# Altium schematic sheet 725169-03 tik_plc4хх.SchDoc
size 594 x 420 mm; ApprovedBy: Бардин; CheckedBy: Налдаев; Author: Сергеев; CompanyName: ООО НПП ТИК; Address1: Address1; Address2: Address2; Address3: Address3; Address4: Address4; DocumentNumber: ИМБР.467459.070 Э3; Revision: Ревизия; SheetNumber: 1; SheetTotal: Кол страниц; Scale: 1:1; Title2str: Плата ЦПУ; NormInspection: Клочкова; Letter1Column: О1; DocumentType: Схема электрическая принципиальная; FirstReferrence: ИМБР.467459.070; NachOtdela: Клочков; GlavConstructor: Бардин; PageSetup: Record=PageOptions|CenterHorizontal=True|CenterVertical=True|PrintScale=0.67|XCorrection=1.00|YCorrection=1.00|PrintKind=2|BorderSize=5000000|LeftOffset=0|BottomOffset=0|Orientation=2|PaperLength=1000|PaperWidth=1000|Scale=100|PaperSource=7|PrintQuality=-3|MediaType=1|DitherType=10|PrintScaleMode=1|PaperKind=A4|PaperIndex=9; Razrabotal: {Разработал}; Proveril: {Проверил}; Tkontr: {Т.контр}; Nkontr: {Н. контр.}; Utverdil: {Утвердил}; Oboznachenie: {Обозначение}; Naimenovanie: {Наименование}; DecimalNumber: ИМБР.467459.070 Э3; HeadOfSector: Нач. сектора; MainDevice: ИМБР.467459.070; Name: Плата ЦПУ; DocumentName: Название документа
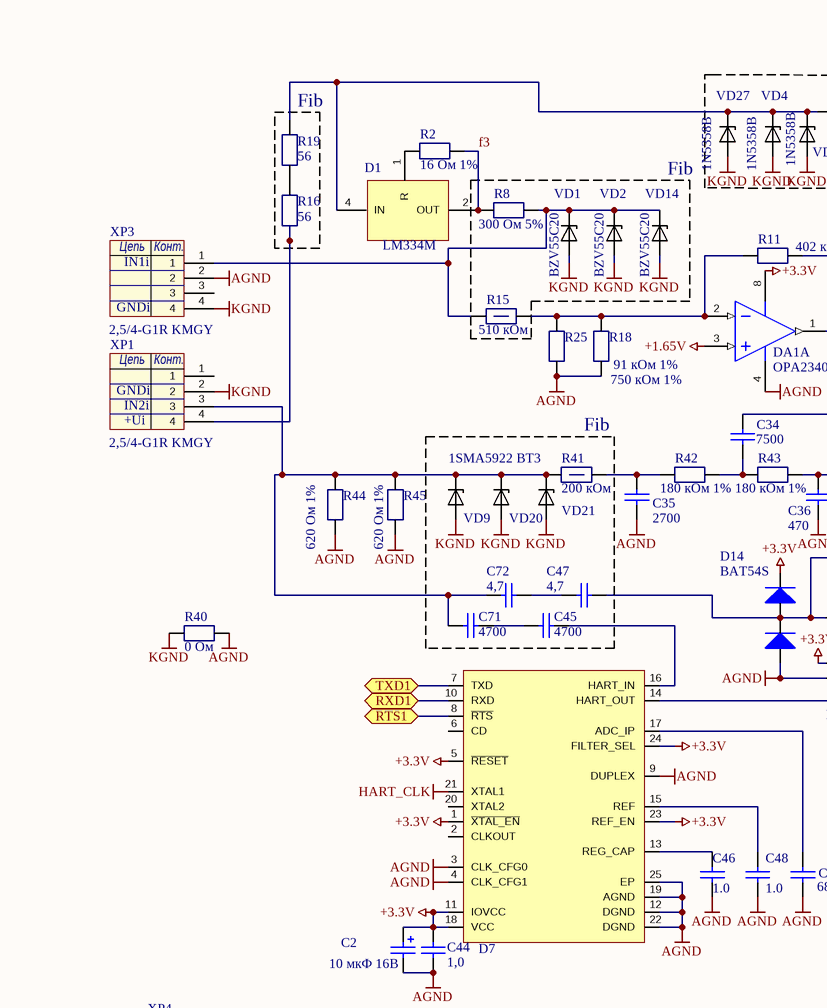
[diagram p0: 725169-03 tik_plc4хх.SchDoc, top left]
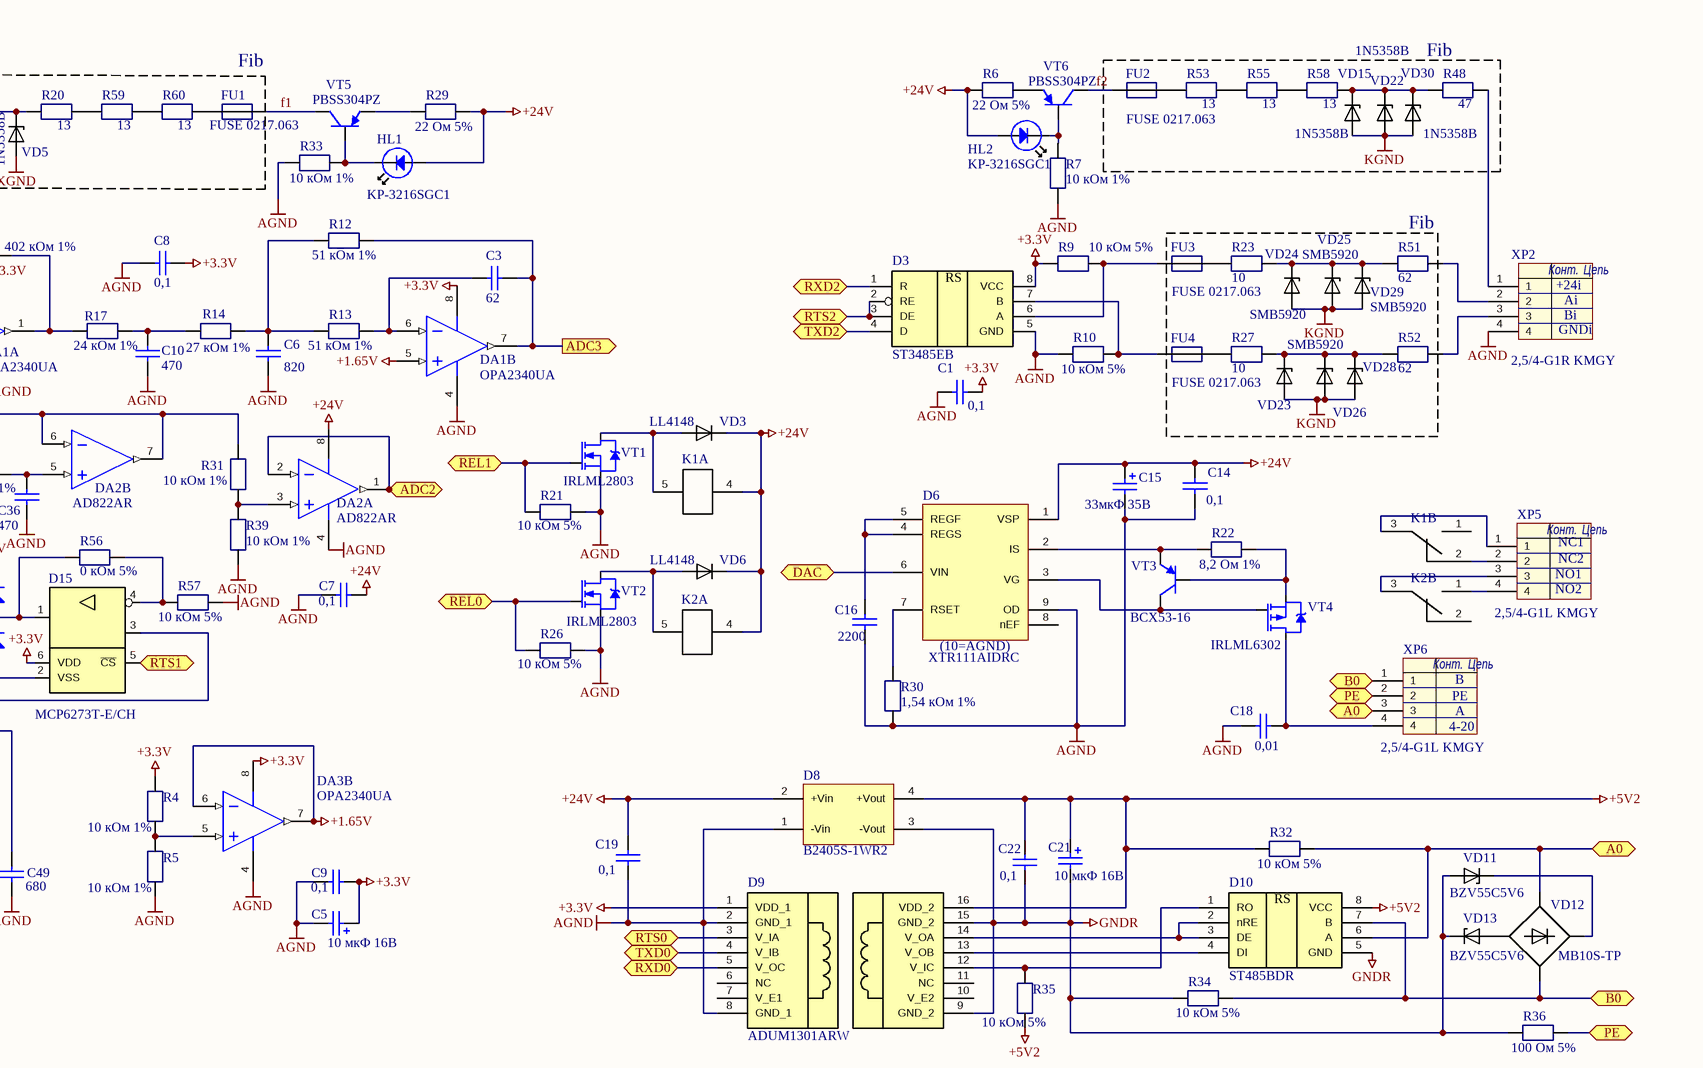
[diagram p1: 725169-03 tik_plc4хх.SchDoc, top right]
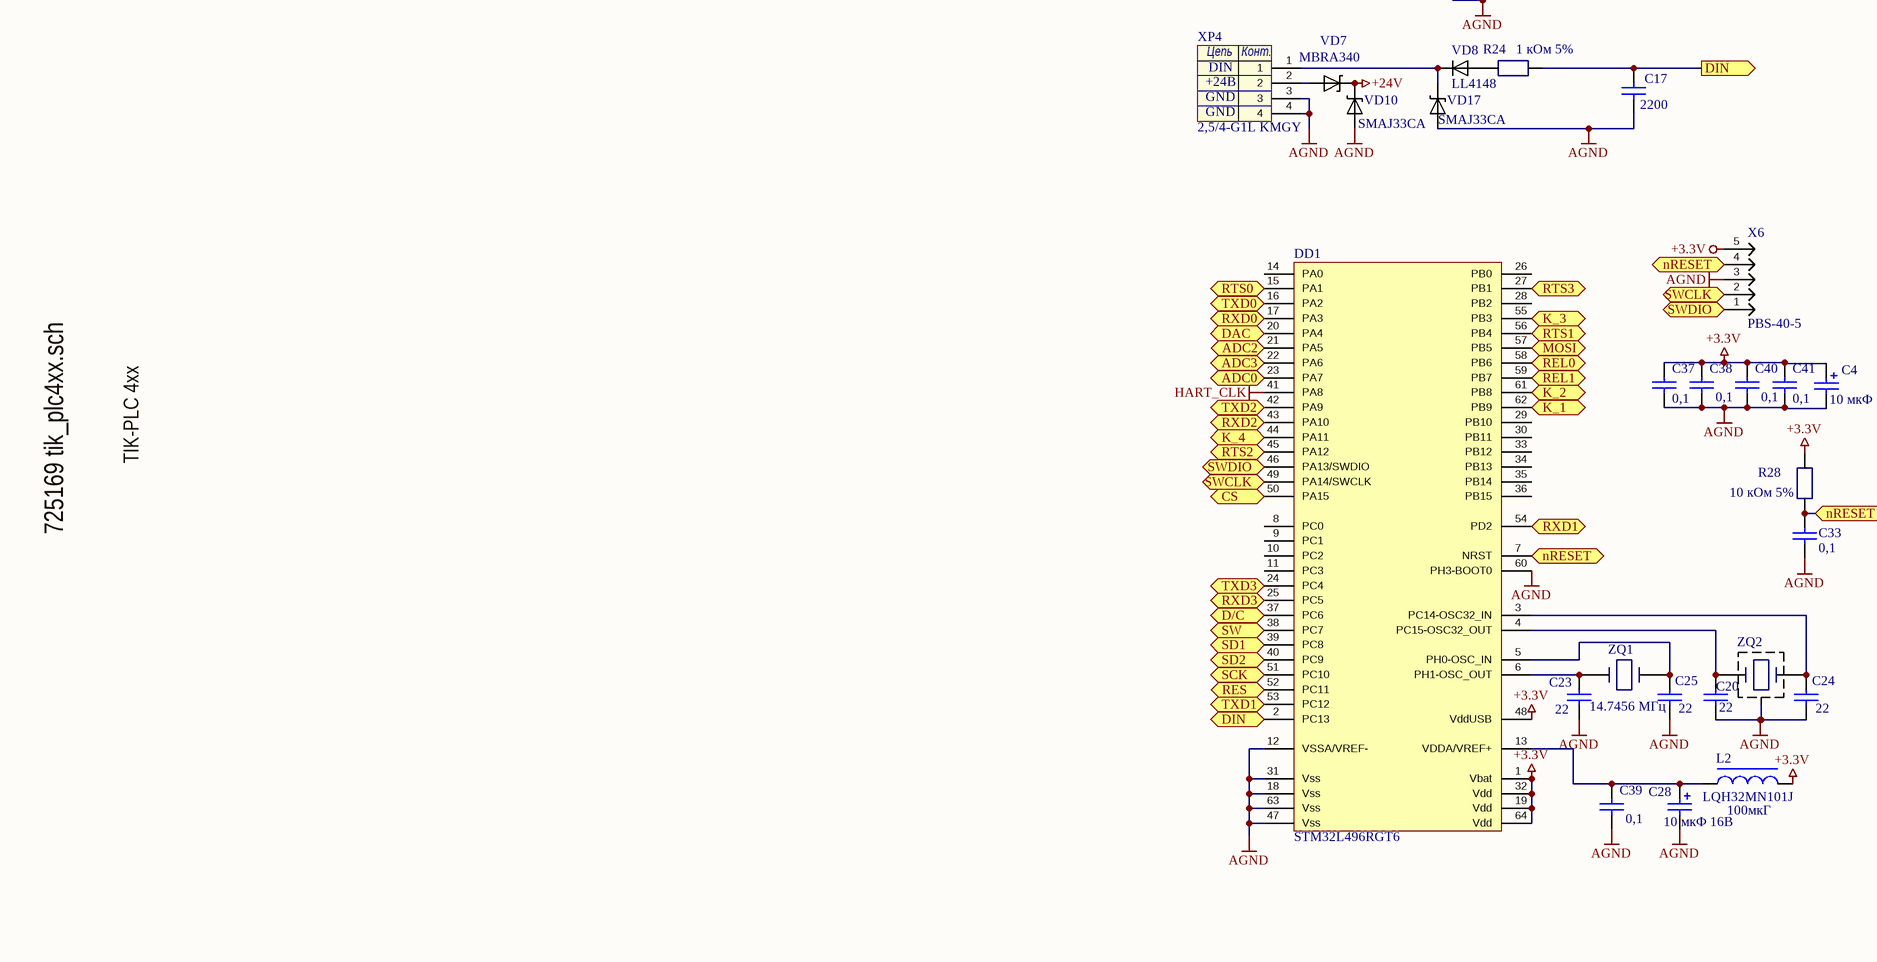
[diagram p2: 725169-03 tik_plc4хх.SchDoc, bottom left]
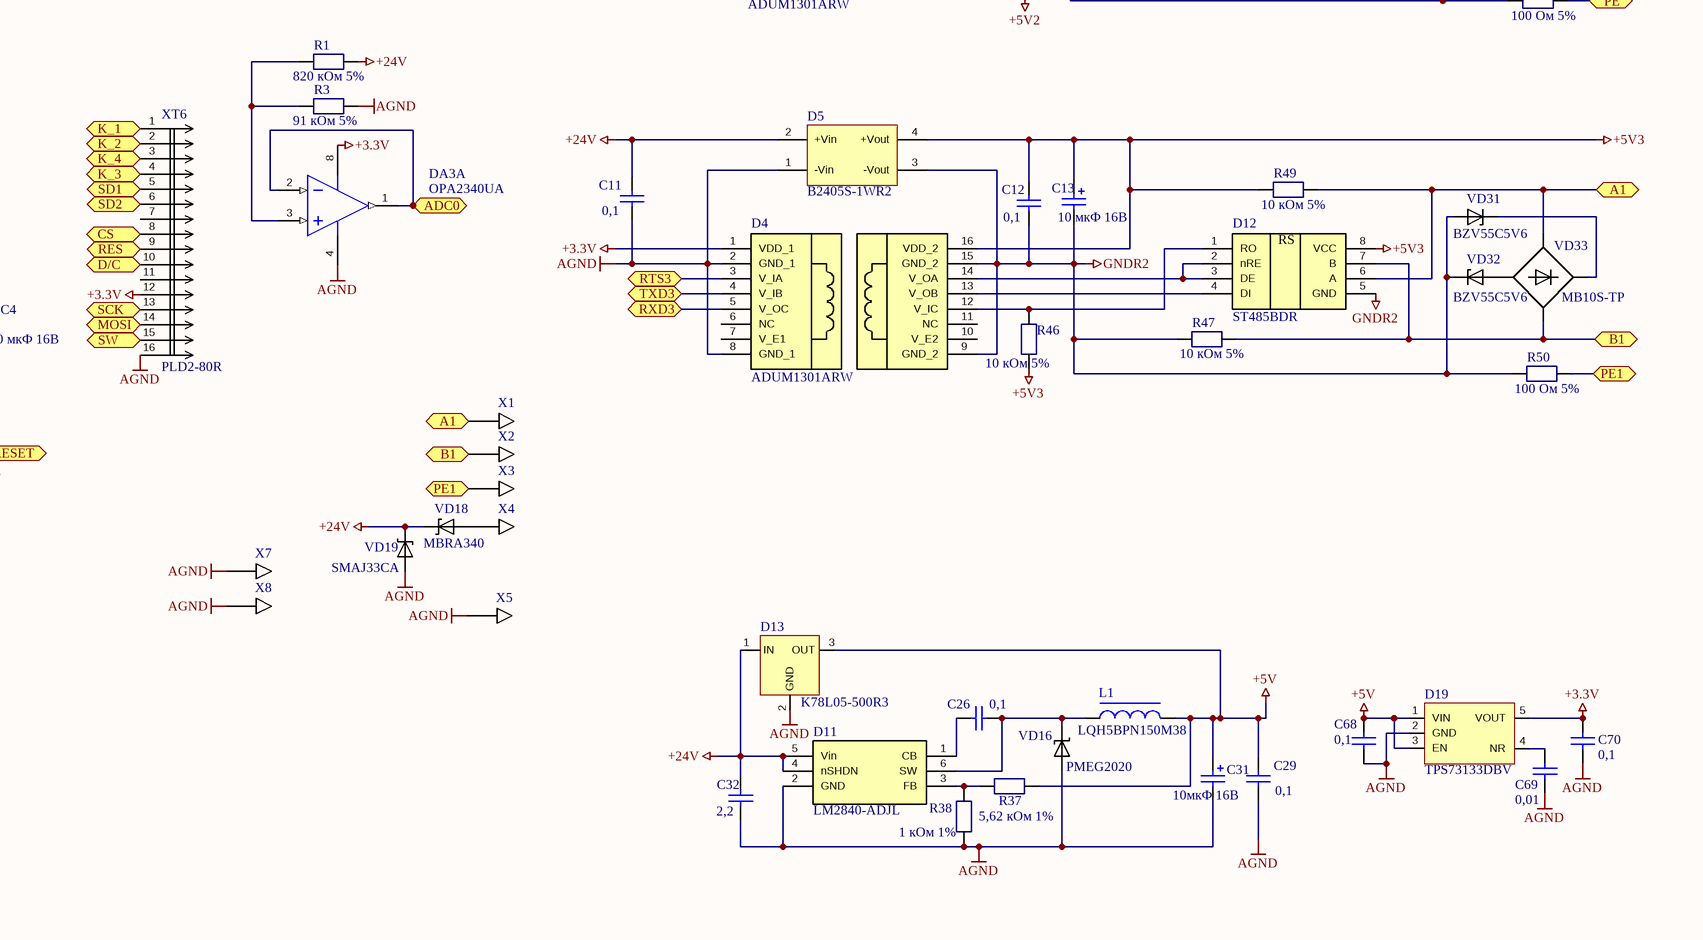
[diagram p3: 725169-03 tik_plc4хх.SchDoc, bottom right]

## Parts
C1  value 0,1  [0805]  (hidden comment: C0805)
C2  10 мкФ 16В  [Case-B]
C3  62  [0805]
C4  10 мкФ 16В  [Case-B]
C5  10 мкФ 16В  [Case-B]
C6  820  [0805]
C7  value 0,1  [0805]  (hidden comment: C0805)
C8  value 0,1  [0805]  (hidden comment: C0805)
C9  value 0,1  [0805]  (hidden comment: C0805)
C10  470  [0805]
C11  value 0,1  [0805]  (hidden comment: C0805)
C12  value 0,1  [0805]  (hidden comment: C0805)
C13  10 мкФ 16В  [Case-B]
C14  value 0,1  [0805]  (hidden comment: C0805)
C15  33мкФ 35В  [Case-D]
C16  2200  [0805]
C17  2200  [0805]
C18  0,01  [0805]
C19  value 0,1  [0805]  (hidden comment: C0805)
C20  value 22  [0805]  (hidden comment: C0805)
C21  10 мкФ 16В  [Case-B]
C22  value 0,1  [0805]  (hidden comment: C0805)
C23  value 22  [0805]  (hidden comment: C0805)
C24  value 22  [0805]  (hidden comment: C0805)
C25  value 22  [0805]  (hidden comment: C0805)
C26  value 0,1  [0805]  (hidden comment: C0805)
C28  10 мкФ 16В  [Case-B]
C29  value 0,1  [0805]  (hidden comment: C0805)
C31  10мкФ 16В  [Case-B]
C32  value 2,2  [0805]  (hidden comment: C0805)
C33  value 0,1  [0805]  (hidden comment: C0805)
C34  7500  [0805]
C35  2700  [0805]
C36  470  [0805]
C37  value 0,1  [0805]  (hidden comment: C0805)
C38  value 0,1  [0805]  (hidden comment: C0805)
C39  value 0,1  [0805]  (hidden comment: C0805)
C40  value 0,1  [0805]  (hidden comment: C0805)
C41  value 0,1  [0805]  (hidden comment: C0805)
C44  value 1,0  [0805]  (hidden comment: C0805)
C45  value 4700  [0805]  (hidden comment: C0805)
C46  value 1.0  [0805]  (hidden comment: C0805)
C47  value 4,7  [0805]  (hidden comment: C0805)
C48  value 1.0  [0805]  (hidden comment: C0805)
C49  value 680  [0805]  (hidden comment: C0805)
C68  value 0,1  [0805]  (hidden comment: C0805)
C69  value 0,01  [0805]  (hidden comment: C0805)
C70  value 0,1  [0805]  (hidden comment: C0805)
C71  value 4700  [0805]  (hidden comment: C0805)
C72  value 4,7  [0805]  (hidden comment: C0805)
D1  LM334М  [SOIC-8]
D3  ST3485EB  [SOIC-8]
D4  ADUM1301ARW  [SOL-16]
D5  B2405S-1WR2  [SIP-4]
D6  XTR111AIDRC  [QFN-10]
D7  AD5700  [QFN24_4x4]  (value not drawn)
D8  B2405S-1WR2  [SIP-4]
D9  ADUM1301ARW  [SOL-16]
D10  ST485BDR  [SOIC-8]
D11  LM2840-ADJL  [G6]
D12  ST485BDR  [SOIC-8]
D13  K78L05-500R3  [K78Lxx-500R3]
D14  BAT54S  [SOT-23]
D15  MCP6273T-E/CH  [SOT23-6]
D19  TPS73133DBV  [SOT23-5]
DA1  OPA2340UA  [SOIC-8]  (parts A,B of 2)
DA2  AD822AR  [SOIC-8]  (parts A,B of 2)
DA3  OPA2340UA  [SOIC-8]  (parts A,B of 2)
DD1  STM32L496RGT6  [LQFP64_L]
FU1  FUSE 0217.063  [FUSE]
FU2  FUSE 0217.063  [FUSE]
FU3  FUSE 0217.063  [FUSE]
FU4  FUSE 0217.063  [FUSE]
HL1  KP-3216SGC1  [KP-3216SGC1]
HL2  KP-3216SGC1  [KP-3216SGC1]
K1  G5Q-14EU-24VDC  [G5Q]  (value not drawn)  (parts A,B of 2)
K2  G5Q-14EU-24VDC  [G5Q]  (value not drawn)  (parts A,B of 2)
L1  LQH5BPN150M38  [LQH5BPN]
L2  LQH32MN101J  value 100мкГ  [1210]
R1  820 кОм 5%  [P1206]
R2  value 16 Ом 1%  [P0805]  (hidden comment: R0805 (1%))
R3  91 кОм 5%  [P1206]
R4  value 10 кОм 1%  [P0805]  (hidden comment: R0805 (1%))
R5  value 10 кОм 1%  [P0805]  (hidden comment: R0805 (1%))
R6  value 22 Ом 5%  [P0805]  (hidden comment: R0805 (1%))
R7  value 10 кОм 1%  [P0805]  (hidden comment: R0805 (1%))
R8  value 300 Ом 5%  [2512]  (hidden comment: R2512 (5%))
R9  value 10 кОм 5%  [P0805]  (hidden comment: R0805 (1%))
R10  value 10 кОм 5%  [P0805]  (hidden comment: R0805 (1%))
R11  402 кОм 1%  [R0805]
R12  51 кОм 1%  [P0805]
R13  51 кОм 1%  [P0805]
R14  27 кОм 1%  [P0805]
R15  value 510 кОм  [C2-33H-0,5]  (hidden comment: C2-33Н-0.5)
R16  value 56  [2512]  (hidden comment: R2512 (5%))
R17  24 кОм 1%  [P0805]
R18  91 кОм 1%  [P0805]
R19  value 56  [2512]  (hidden comment: R2512 (5%))
R20  value 13  [2512]  (hidden comment: R2512 (5%))
R21  value 10 кОм 5%  [P0805]  (hidden comment: R0805 (1%))
R22  value 8,2 Ом 1%  [P0805]  (hidden comment: R0805 (1%))
R23  value 10  [2512]  (hidden comment: R2512 (5%))
R24  1 кОм 5%  [P1206]
R25  750 кОм 1%  [P0805]
R26  value 10 кОм 5%  [P0805]  (hidden comment: R0805 (1%))
R27  value 10  [2512]  (hidden comment: R2512 (5%))
R28  value 10 кОм 5%  [P0805]  (hidden comment: R0805 (1%))
R29  value 22 Ом 5%  [P0805]  (hidden comment: R0805 (1%))
R30  value 1,54 кОм 1%  [P0805]  (hidden comment: R0805 (1%))
R31  value 10 кОм 1%  [P0805]  (hidden comment: R0805 (1%))
R32  value 10 кОм 5%  [P0805]  (hidden comment: R0805 (1%))
R33  value 10 кОм 1%  [P0805]  (hidden comment: R0805 (1%))
R34  value 10 кОм 5%  [P0805]  (hidden comment: R0805 (1%))
R35  value 10 кОм 5%  [P0805]  (hidden comment: R0805 (1%))
R36  value 100 Ом 5%  [P0805]  (hidden comment: R0805 (1%))
R37  value 5,62 кОм 1%  [P0805]  (hidden comment: R0805 (1%))
R38  value 1 кОм 1%  [P0805]  (hidden comment: R0805 (1%))
R39  value 10 кОм 1%  [P0805]  (hidden comment: R0805 (1%))
R40  0 Ом  [P1206]
R41  value 200 кОм  [C2-33H-0,5]  (hidden comment: C2-33Н-0.5)
R42  180 кОм 1%  [P0805]
R43  180 кОм 1%  [P0805]
R44  620 Ом 1%  [P0805]
R45  620 Ом 1%  [P0805]
R46  value 10 кОм 5%  [P0805]  (hidden comment: R0805 (1%))
R47  value 10 кОм 5%  [P0805]  (hidden comment: R0805 (1%))
R48  value 47  [2512]  (hidden comment: R2512 (5%))
R49  value 10 кОм 5%  [P0805]  (hidden comment: R0805 (1%))
R50  value 100 Ом 5%  [P0805]  (hidden comment: R0805 (1%))
R51  value 62  [2512]  (hidden comment: R2512 (5%))
R52  value 62  [2512]  (hidden comment: R2512 (5%))
R53  value 13  [2512]  (hidden comment: R2512 (5%))
R55  value 13  [2512]  (hidden comment: R2512 (5%))
R56  value 0 кОм 5%  [P0805]  (hidden comment: R0805 (1%))
R57  value 10 кОм 5%  [P0805]  (hidden comment: R0805 (1%))
R58  value 13  [2512]  (hidden comment: R2512 (5%))
R59  value 13  [2512]  (hidden comment: R2512 (5%))
R60  value 13  [2512]  (hidden comment: R2512 (5%))
VD1  BZV55C20  [SOD-80 (1)]
VD2  BZV55C20  [SOD-80 (1)]
VD3  LL4148  [SOD-80]
VD4  1N5358B  [DO-201 Vertical]
VD5  1N5358B  [DO-201 Vertical Flip]
VD6  LL4148  [SOD-80]
VD7  MBRA340  [SMA]
VD8  LL4148  [SOD-80 (1)]
VD9  1SMA5922 BT3  [SMA]  (value not drawn)
VD10  SMAJ33СA  [SMA]
VD11  BZV55C5V6  [SOD-80 (1)]
VD12  MB10S-TP  [SOP-4]
VD13  BZV55C5V6  [SOD-80 (1)]
VD14  BZV55C20  [SOD-80 (1)]
VD15  1N5358B  [DO-201 Vertical]
VD16  PMEG2020  [SOD-323]
VD17  SMAJ33СA  [SMA]
VD18  MBRA340  [SMA]
VD19  SMAJ33СA  [SMA]
VD20  1SMA5922 BT3  [SMA]
VD21  1SMA5922 BT3  [SMA]  (value not drawn)
VD22  1N5358B  [DO-201 Vertical Flip]
VD23  SMB5920  [SMB]
VD24  SMB5920  [SMB]
VD25  SMB5920  [SMB]
VD26  SMB5920  [SMB]  (value not drawn)
VD27  1N5358B  [DO-201 Vertical]
VD28  SMB5920  [SMB]  (value not drawn)
VD29  SMB5920  [SMB]
VD30  1N5358B  [DO-201 Vertical Flip]
VD31  BZV55C5V6  [SOD-80 (1)]
VD32  BZV55C5V6  [SOD-80 (1)]
VD33  MB10S-TP  [SOP-4]
VT1  IRLML2803  [SOT-23]
VT2  IRLML2803  [SOT-23]
VT3  BCX53-16  [SOT89]
VT4  IRLML6302  [SOT-23]
VT5  PBSS304PZ  [SOT223]
VT6  PBSS304PZ  [SOT223]
X1  (no value)  [P-polygon]
X2  (no value)  [P-polygon]
X3  (no value)  [P-polygon]
X4  (no value)  [P-polygon]
X5  (no value)  [P-polygon]
X6  PBS-40-5  [PLS-40-5 (1)]
X7  (no value)  [P-circle 2-d1]
X8  (no value)  [P-circle 2-d1]
XP1  XP3  [MSTBO-2.5/4-G1R]  (value not drawn)
XP2  XT?  [MSTBO-2.5/4-G1R]  (value not drawn)
XP3  XP1  [MSTBO-2.5/4-G1R]  (value not drawn)
XP4  XT4  [MSTBO-2.5/4-G1L]  (value not drawn)
XP5  XT4  [MSTBO-2.5/4-G1L]  (value not drawn)
XP6  XT5  [MSTBO-2.5/4-G1L]  (value not drawn)
XT6  PLD2-80R  [PlD2-16R---]
ZQ1  14.7456 МГц  [HC-49/U]
ZQ2  (no value)  [DT-38T]

## Blocks framed on the sheet
Fib: FU2 R48 R53 R55 R58 VD15 VD22 VD30
Fib: R16 R19
Fib: FU1 R20 R59 R60 VD4 VD5 VD27
Fib: R8 R15 VD1 VD2 VD14
Fib: FU3 FU4 R23 R27 R51 R52 VD23-VD26 VD28 VD29
Fib: C45 C47 C71 C72 R41 VD9 VD20 VD21

## Ports
A0, A1, A1 (in), ADC0 (out), ADC2, ADC3 (out), B0, B1, B1 (in), CS, D/C, DAC, DIN (in), DIN (out), K_1, K_2, K_3, K_4, MOSI, nRESET, PE, PE1, PE1 (in), REL0, REL0 (out), REL1, REL1 (out), RES, RTS0, RTS1, RTS2, RTS3, RXD0, RXD1, RXD2, RXD3, SCK, SD1, SD1 (in), SD2, SW (in), SW (out), SWCLK, SWDIO, TXD0, TXD1, TXD2, TXD3

## Nets
+1.65V: DA1.3(IN+) DA1.5(IN+) DA3.6(IN-) DA3.7(OUT)
+3.3V: C1.2 C2.1 C4.1 C5.1 C8.1 C9.1 C37.2 C38.2 C40.2 C41.2 C44.2 C70.2 D3.8(VCC) D4.1(VDD_1) D7.1(~{XTAL_EN}) D7.5(~{RESET}) D7.11(IOVCC) D7.18(VCC) D7.23(REF_EN) D7.24(FILTER_SEL) D9.1(VDD_1) D14.2(A2) D15.6(VDD) D19.5(VOUT) DA1.8(V+) DA3.8(V+) DD1.1(Vbat) DD1.19(Vdd) DD1.32(Vdd) DD1.48(VddUSB) DD1.64(Vdd) L2.2 R4.2 R9.1 R28.1 X6.5 XT6.12
+5V: C29.2 C31.1 C68.2 D13.3(OUT) D19.1(VIN) D19.3(EN) L1.2 R37.2
+5V2: C21.1 C22.2 D8.4(+Vout) D9.16(VDD_2) D10.8(VCC) R32.2 R35.2
+5V3: C12.2 C13.1 D4.16(VDD_2) D5.4(+Vout) D12.8(VCC) R46.2 R49.2
+24V: C7.1 C11.2 C14.1 C15.1 C19.2 C32.2 D5.2(+Vin) D6.1(VSP) D8.2(+Vin) D11.4(nSHDN) D11.5(Vin) D13.1(IN) DA2.8(V+) HL1.1(A) HL2.1(A) K1.4(A) K2.4(A) R1.1 R6.1 R29.2 VD3.1(K) VD6.1(K) VD7.1(K) VD10.1(K) VD18.1(K) VD19.1(K)
AGND: C1.1 C2.2 C4.2 C5.2 C6.2 C7.2 C8.2 C9.2 C10.2 C11.1 C14.2 C15.2 C16.2 C17.2 C18.1 C19.1 C20.1 C23.1 C24.1 C25.1 C28.2 C29.1 C31.2 C32.1 C33.1 C35.2 C36.2 C37.1 C38.1 C39.1 C40.1 C41.1 C44.1 C46.1 C48.1 C49.1 C68.1 C69.1 C70.1 D3.5(GND) D4.2(GND_1) D4.8(GND_1) D5.1(-Vin) D6.9(OD) D6.10 D6.11 D7.3(CLK_CFG0) D7.4(CLK_CFG1) D7.9(DUPLEX) D7.12(DGND) D7.19(AGND) D7.22(DGND) D7.25(EP) D8.1(-Vin) D9.2(GND_1) D9.8(GND_1) D11.2(GND) D13.2(GND) D14.1(A1) D15.2(VSS) D19.2(GND) DA1.4(V-) DA2.4(V-) DA3.4(V-) DD1.12(VSSA/VREF-) DD1.18(Vss) DD1.31(Vss) DD1.47(Vss) DD1.60(PH3-BOOT0) DD1.63(Vss) R3.1 R5.1 R7.2 R10.2 R18.2 R21.1 R25.2 R26.1 R30.2 R33.1 R38.2 R39.1 R40.2 R44.2 R45.2 R57.2 VD10.2(A) VD16.1(A) VD17.2(A) VD19.2(A) VT1.2(S) VT2.2(S) X5.1(X) X6.3 X7.1(X) X8.1(X) XP2.4 XP3.2 XP4.3 XP4.4 XT6.16 ZQ2.3
f1: FU1.1 VT5.2(C) VT5.4
f2: FU2.2 VT6.2(C) VT6.4
f3: D1.2(OUT) D1.3 D1.6 D1.7 R2.1 R8.2
GNDR: C21.2 C22.1 D8.3(-Vout) D9.9(GND_2) D9.15(GND_2) D10.5(GND) R34.2 R36.2 VD11.2(A) VD13.1(K)
GNDR2: C12.1 C13.2 D4.9(GND_2) D4.15(GND_2) D5.3(-Vout) D12.5(GND) R47.2 R50.2 VD31.2(A) VD32.1(K)
HART_CLK: D7.21(XTAL1) DD1.41(PA8)
KGND: R40.1 VD1.2(A) VD2.2(A) VD4.2(A) VD5.2(A) VD9.2(A) VD14.2(A) VD15.2(A) VD20.2(A) VD21.2(A) VD22.2(A) VD23.2(A) VD24.2(A) VD25.2(A) VD26.2(A) VD27.2(A) VD28.2(A) VD29.2(A) VD30.2(A) XP1.2 XP3.4
A0: D10.6(A) R32.1 VD12.1 XP6.3 ; port A0
A1: D12.6(A) R49.1 VD33.1 X1.1(X) ; port A1
ADC0: DA3.1(OUT) DA3.2(IN-) DD1.23(PA7) ; port ADC0
ADC2: DA2.1(OUT1) DA2.2(IN1-) DD1.21(PA5) ; port ADC2
ADC3: C3.2 DA1.7(OUT) DD1.22(PA6) R12.1 ; port ADC3
B0: D10.7(B) R34.1 VD12.2 XP6.1 ; port B0
B1: D12.7(B) R47.1 VD33.2 X2.1(X) ; port B1
CS: DD1.50(PA15) XT6.8 ; port CS
D/C: DD1.37(PC6) XT6.10 ; port D/C
DAC: D6.6(VIN) DD1.20(PA4) ; port DAC
DIN: C17.1 DD1.2(PC13) R24.2 ; port DIN
K_1: DD1.62(PB9) XT6.1 ; port K_1
K_2: DD1.61(PB8) XT6.2 ; port K_2
K_3: DD1.55(PB3) XT6.4 ; port K_3
K_4: DD1.44(PA11) XT6.3 ; port K_4
MOSI: DD1.57(PB5) XT6.14 ; port MOSI
nRESET: C33.2 DD1.7(NRST) R28.2 X6.4 ; port nRESET
PE: R36.1 XP6.2 ; port PE
PE1: R50.1 X3.1(X) ; port PE1
REL0: DD1.58(PB6) R26.2 VT2.1(G) ; port REL0
REL1: DD1.59(PB7) R21.2 VT1.1(G) ; port REL1
RES: DD1.52(PC11) XT6.9 ; port RES
RTS0: D9.3(V_IA) DD1.15(PA1) ; port RTS0
RTS1: D7.8(~{RTS}) D15.5(~{CS}) DD1.56(PB4) ; port RTS1
RTS2: D3.2(RE) D3.3(DE) DD1.45(PA12) ; port RTS2
RTS3: D4.3(V_IA) DD1.27(PB1) ; port RTS3
RXD0: D9.5(V_OC) DD1.17(PA3) ; port RXD0
RXD1: D7.10(RXD) DD1.54(PD2) ; port RXD1
RXD2: D3.1(R) DD1.43(PA10) ; port RXD2
RXD3: D4.5(V_OC) DD1.25(PC5) ; port RXD3
SCK: DD1.51(PC10) XT6.13 ; port SCK
SD1: DD1.39(PC8) XT6.5 ; port SD1
SD2: DD1.40(PC9) XT6.6 ; port SD2
SW: DD1.38(PC7) XT6.15 ; port SW
SWCLK: DD1.49(PA14/SWCLK) X6.2 ; port SWCLK
SWDIO: DD1.46(PA13/SWDIO) X6.1 ; port SWDIO
TXD0: D9.4(V_IB) DD1.16(PA2) ; port TXD0
TXD1: D7.7(TXD) DD1.53(PC12) ; port TXD1
TXD2: D3.4(D) DD1.42(PA9) ; port TXD2
TXD3: D4.4(V_IB) DD1.24(PC4) ; port TXD3
NetC3_1: C3.1 DA1.6(IN-) R13.1
NetC6_1: C6.1 R12.2 R13.2 R14.1
NetC10_1: C10.1 R14.2 R17.2
NetC16_1: C16.1 D6.4(REGS) D6.5(REGF)
NetC18_2: C18.2 VT4.3(D) XP6.4
NetC20_2: C20.2 DD1.4(PC15-OSC32_OUT) ZQ2.1
NetC23_2: C23.2 DD1.6(PH1-OSC_OUT) ZQ1.2
NetC24_2: C24.2 DD1.3(PC14-OSC32_IN) ZQ2.2
NetC25_2: C25.2 DD1.5(PH0-OSC_IN) ZQ1.1
NetC26_1: C26.1 D11.6(SW) L1.1 VD16.2(K)
NetC26_2: C26.2 D11.1(CB)
NetC28_1: C28.1 C39.2 DD1.13(VDDA/VREF+) L2.1
NetC34_1: C34.1 R42.2 R43.1
NetC34_2: C34.2 DA2.6(IN2-) DA2.7(OUT2) R31.1
NetC35_1: C35.1 R41.1 R42.1
NetC36_1: C36.1 DA2.5(IN2+) R43.2
NetC45_1: C45.1 D7.16(HART_IN)
NetC45_2: C45.2 C71.2
NetC46_2: C46.2 D7.13(REG_CAP)
NetC47_1: C47.1 D14.3(K) D15.1 R56.1
NetC47_2: C47.2 C72.2
NetC48_2: C48.2 D7.15(REF)
NetC49_2: C49.2 D7.17(ADC_IP)
NetC69_2: C69.2 D19.4(NR)
NetC71_1: C71.1 C72.1 R41.2 R44.1 R45.1 VD9.1(K) VD20.1(K) VD21.1(K) XP1.3
NetD1_1: D1.1(R) R2.2
NetD1_4: D1.4(IN) R19.2 R20.1 VD4.1(K) VD5.1(K) VD27.1(K)
NetD3_6: D3.6(A) FU3.2 R9.2
NetD3_7: D3.7(B) FU4.2 R10.1
NetD4_12: D4.12(V_IC) D12.1(RO) R46.1
NetD4_13: D4.13(V_OB) D12.4(DI)
NetD4_14: D4.14(V_OA) D12.2(nRE) D12.3(DE)
NetD6_2: D6.2(IS) R22.2 VT3.1(E)
NetD6_3: D6.3(VG) VT3.2(C) VT4.1(G)
NetD6_7: D6.7(RSET) R30.1
NetD7_14: D7.14(HART_OUT) D15.3
NetD9_12: D9.12(V_IC) D10.1(RO) R35.1
NetD9_13: D9.13(V_OB) D10.4(DI)
NetD9_14: D9.14(V_OA) D10.2(nRE) D10.3(DE)
NetD11_3: D11.3(FB) R37.1 R38.1
NetD15_4: D15.4 R56.2 R57.1
NetDA1_1: DA1.1(OUT) R11.1 R17.1
NetDA1_2: DA1.2(IN-) R11.2 R15.1 R18.1 R25.1
NetDA2_3: DA2.3(IN1+) R31.2 R39.2
NetDA3_3: DA3.3(IN+) R1.2 R3.2
NetDA3_5: DA3.5(IN+) R4.1 R5.2
NetFU1_2: FU1.2 R60.2
NetFU2_1: FU2.1 R53.1
NetFU3_1: FU3.1 R23.1
NetFU4_1: FU4.1 R27.1
NetHL1_2: HL1.2(K) R33.2 VT5.1(B)
NetHL2_2: HL2.2(K) R7.1 VT6.1(B)
NetK1_2: K1.2(lock) XP5.2
NetK1_3: K1.3(over) XP5.1
NetK1_5: K1.5(B) VD3.2(A) VT1.3(D)
NetK2_1: K2.1(open) XP5.4
NetK2_3: K2.3(over) XP5.3
NetK2_5: K2.5(B) VD6.2(A) VT2.3(D)
NetR6_2: R6.2 VT6.3(E)
NetR8_1: R8.1 R15.2 VD1.1(K) VD2.1(K) VD14.1(K) XP3.1
NetR16_1: R16.1 XP1.4
NetR16_2: R16.2 R19.1
NetR20_2: R20.2 R59.1
NetR22_1: R22.1 VT3.3(B) VT4.2(S)
NetR23_2: R23.2 R51.1 VD24.1(K) VD25.1(K) VD29.1(K)
NetR24_1: R24.1 VD8.2(A)
NetR27_2: R27.2 R52.1 VD23.1(K) VD26.1(K) VD28.1(K)
NetR29_1: R29.1 VT5.3(E)
NetR48_1: R48.1 R58.2 VD15.1(K) VD22.1(K) VD30.1(K)
NetR48_2: R48.2 XP2.1
NetR51_2: R51.2 XP2.2
NetR52_2: R52.2 XP2.3
NetR53_2: R53.2 R55.1
NetR55_2: R55.2 R58.1
NetR59_2: R59.2 R60.1
NetVD7_2: VD7.2(A) XP4.2
NetVD8_1: VD8.1(K) VD17.1(K) XP4.1
NetVD11_1: VD11.1(K) VD12.3(+)
NetVD12_4: VD12.4(-) VD13.2(A)
NetVD18_2: VD18.2(A) X4.1(X)
NetVD31_1: VD31.1(K) VD33.3(+)
NetVD32_2: VD32.2(A) VD33.4(-)

Not connected (* = marked no-connect by the designer): D4 6(NC) 7(V_E1) 10(V_E2) 11(NC); D6 8(nEF); D7 2(CLKOUT) 6(CD) 20(XTAL2); D9 6(NC) 7(V_E1) 10(V_E2) 11(NC); DD1 8(PC0) 9(PC1) 10(PC2) 11(PC3) 14(PA0) 26(PB0) 28(PB2) 29(PB10) 30(PB11) 33(PB12) 34(PB13) 35(PB14) 36(PB15); K1 1(open); K2 2(lock); XP1 1; XP3 3; XT6 7 11

## Notes on the sheet
- (near XP3) GNDi
- (near XP3) IN1i
- (near XP2) +24i
- (near XP2) Ai
- (near XP2) Bi
- (near XP1) GNDi
- (near XP2) GNDi
- (near XP1) IN2i
- (near XP1) +Ui
- (near XP5) NC1
- (near XP5) NO2
- (near XP5) NO1
- (near XP5) NC2
- PE
- B
- (near XP6) 4-20
- (near XP6) A
- (near XP4) +24B
- (near XP4) GND
- (near XP4) DIN
- TIK-PLC 4хх
- 725169 tik_plc4хх.sch
- Перв.примен.
- Справ.№
- Подп. и дата
- Инв.№ дубл.
- Взам.инв.№
- Подп.и дата
- Разраб.
- Изм.
- Лист
- № докум.
- Подп.
- Дата
- Лит.
- Масштаб
- Масса
- Т.контр.
- Пров.
- СХЕМА   ЭЛЕКТРИЧЕСКАЯ
- ПРИНЦИПИАЛЬНАЯ
- Листов
- Инв.№ подл.
- Утв.
- Н.контр.
- Нач.сект.
- Формат  A2
- (in symbol ADM485AR) RS
- (in symbol ST3485EB) RS
- (in symbol TB-) Цепь; Конт.; 2,5/4-G1R KMGY; 2,5/4-G1L KMGY
- (in symbol XTR111) (10=AGND)

## Library data of the parts
C1 C7-C9 C11 C12 C14 C19 C22 C26 C29 C33 C37-C41 C44 C68-C70 = C0805: Чип конденсатор 0805; SP: X7R-0,1 мкФ ±10% -50В
C2 C4 C5 C13 C21 C28 = Tantal "B": Чип конденсатор танталовый "B"; SP: Конденсатор КТ-16В-10 мкФ 10% "B"; Value: 10 мкФ 16В
C3 = C1812: SP: NPO-6800пФ ±5% -50В; Value: 62
C6 = C1812: SP: NPO-2700пФ ±5% -50В; Value: 820
C10 = C1812: SP: X7R-1 мкФ ±10% -50В; Value: 470
C15 = Tantal "C": Чип конденсатор танталовый "C"; SP: Чип конденсатор 47 мкФ 10В 20% "С"; Value: 33мкФ 35В
C16 C17 = C1812: SP: X7R-2200пФ ±10% -50В; Value: 2200
C18 = C1812: SP: X7R-0,01 мкФ ±10% -50В; Value: 0,01
C20 C23-C25 = C0805: Чип конденсатор 0805; SP: NPO-22пФ ±5% -50В
C31 = Tantal "A": Чип конденсатор танталовый "B"; SP: Конденсатор КТ-16В-10 мкФ 10% "B"; Value: 10мкФ 16В
C32 = C0805: Чип конденсатор 0805; SP: X7R-2,2 мкФ ±10% -50В
C34 = C1812: SP: NPO-1500 пФ ±5% -50В; Value: 7500
C35 = C1812: SP: NPO-1000 пФ ±5% -50В; Value: 2700
C36 = C1812: SP: NPO-100 пФ ±5% -50В; Value: 470
C45 = C0805: Чип конденсатор 0805; SP: X7R-2200 пФ ±10% -50В
C46 C48 = C0805: Чип конденсатор 0805; SP: X7R-1 мкФ ±10% -50В
C47 = C0805: Чип конденсатор 0805; SP: X7R-2.2 мкФ ±10% -50В
C49 = C0805: Чип конденсатор 0805; SP: X7R-680 пФ ±10% -50В
C71 C72 = C0805: Чип конденсатор 0805; SP: Чип конденсатор 0805 X7R 0,1 мкФ 10% 50В
D1 = REF30: SP: Микросхема LM334М; Value: LM334М
D3 = ST3485EB: UART to RS485; Value: ST3485EB
D4 D9 = ADUM1301ARW: SP: Микросхема ADUM1301ARW; Value: ADUM1301ARW
D5 D8 = AM1S-0505SZ: DC-DC изолированный преобразователь; SP: Микросхема TME0505S; Value: B2405S-1WR2
D6 = XTR111: АЦП 16-Bit, 100 kSPS PulSAR; SP: Микросхема XTR111AIDRC; Value: XTR111AIDRC
D7 = AD5700: AD5700 Low Power HART Modem; Value: AD5700
D10 D12 = ADM485AR: SP: Микросхема ST485BDR; Value: ST485BDR
D11 = LM2840: SP: Микросхема LM2840-ADJL; Value: LM2840-ADJL
D13 = K78Lxx-500R3: Step Down DC-DC; SP: K78Lxx-500R3; Value: K78L05-500R3
D15 = MCP6273T-E/CH: 170 µA, 2 MHz Rail-to-Rail Op Amp; Value: MCP6273T-E/CH
D19 = TPS73133DBV: Источник опорного напряжения 2.5В, SOT23; SP: TPS73133DBV
DA1 DA3 = OPA2340: 2.7V, 5.5MHz Rail-to-Rail I/O Amplifier; SP: OPA2340UA
DD1 = STM32L4A6RG: Ultra-low-power with FPU Arm Cortex-M4 MCU 80 MHz with 1 Mbyte Flash memory, 320 Kbyte of SRAM; Value: STM32L496RGT6
FU1-FU4 = FUSE 216: SP: Предохранитель FUSE 0217.063; Value: FUSE 0217.063
HL1 = KP-3216SGC1: SP: Светодиод KP-3216 SGC (зеленый)
K1 K2 = G5Q-14EU-24VDC: Реле 3A 250V; Value: G5Q-14EU-24VDC
L1 = LQH5BPN100M38K: SMD Дроссель 5x5 mm; SP: Дроссель LQH5BPN150M38; Value: LQH5BPN150M38
L2 = LQH32MN101J (1210): SMD Дроссель (1210); SP: Дроссель LQH32MN101J 100мкГ
R1 = R1206: Чип резистор 1206; SP: 0,25-820 кОм ±5%; Value: 820 кОм 5%
R2 R22 = R0805 (1%): Чип резистор 0805, 1%; SP: 0,125-8,2 Ом ±1%
R3 = R1206: Чип резистор 1206; SP: 0,25-91 кОм ±5%; Value: 91 кОм 5%
R4 R5 R9 R10 R21 R26 R31 R32 R34 R35 R39 R46 R47 R49 R56 R57 = R0805 (1%): Чип резистор 0805, 1%; SP: 0,125-10 кОм ±5%
R6 R29 = R0805 (1%): Чип резистор 0805, 1%; SP: 0,125-22 Ом ±5%
R7 = R0805 (1%): Чип резистор 0805, 1%; SP: Чип резистор 0805 120 Ом 1%
R8 = R2512 (5%): Чип резистор 2512, 5%; SP: 1-300 Ом ±5%
R11 = R1206: Чип резистор 1206; SP: 0,25-510 кОм ±1%; Value: 402 кОм 1%
R12 = R1206: Чип резистор 1206; SP: 0,25-115 кОм ±1%; Value: 51 кОм 1%
R13 = R1206: Чип резистор 1206; SP: 0,25-110 кОм ±1%; Value: 51 кОм 1%
R14 = R1206: Чип резистор 1206; SP: 0,25-82 кОм ±1%; Value: 27 кОм 1%
R15 = C2-33Н-0.5: Резистор С2, 5%; SP: Резистор С2-33Н-0,5-510 кОм ±5%-А-В-В
R16 R19 R20 R23 R27 R48 R51 R53 R55 R58-R60 = R2512 (5%): Чип резистор 2512, 5%; SP: Резистор 2512 51 Ом 5%
R17 = R1206: Чип резистор 1206; SP: 0,25-1 МОм ±5%; Value: 24 кОм 1%
R18 R25 = R1206: Чип резистор 1206; SP: 0,25-133 кОм ±1%
  R18: Value: 91 кОм 1%
  R25: Value: 750 кОм 1%
R24 = R1206: Чип резистор 1206; SP: 0,25-1 кОм ±5%; Value: 1 кОм 5%
R28 = R0805 (1%): Чип резистор 0805, 1%; SP: 0,125-5,1 кОм ±5%
R30 = R0805 (1%): Чип резистор 0805, 1%; SP: 0,125-1,54 кОм ±1%
R33 = R0805 (1%): Чип резистор 0805, 1%; SP: 0,125-10 кОм ±1%
R36 R50 = R0805 (1%): Чип резистор 0805, 1%; SP: 0,125-100 Ом ±5%
R37 = R0805 (1%): Чип резистор 0805, 1%; SP: 0,125- 5,62 кОм ±1%
R38 = R0805 (1%): Чип резистор 0805, 1%; SP: 0,125-1 кОм ±1%
R40 R45 = R1206: Чип резистор 1206; SP: 0,25-787 Ом ±1%
  R40: Value: 0 Ом
  R45: Value: 620 Ом 1%
R41 = C2-33Н-0.5: Резистор С2, 5%; SP: Резистор С2-33Н-0,5-200 кОм ±5%
R42 R43 = R1206: Чип резистор 1206; SP: 0,25-330 кОм ±1%; Value: 180 кОм 1%
R44 = R1206: Чип резистор 1206; SP: 0,25-249 Ом ±1%; Value: 620 Ом 1%
R52 = R2512 (5%): Чип резистор 2512, 5%; SP: Резистор 2512 62 Ом 5%
VD1 VD2 VD14 = BZV55C20: Стабилитрон; SP: Стабилитрон BZV55C20; Value: BZV55C20
VD4 VD5 VD15 VD22 VD27 VD30 = 1N5359B: Стабилитрон; SP: Стабилитрон 1N5359B; Value: 1N5358B
VD7 VD18 = MBRA340: Диод Шоттки, 3А, 40В; SP: Диод MBRA340T3G; Value: MBRA340T3G
VD8 = LL4148: SP: Диод LL4148; Value: LL4148
VD9 VD20 VD21 = BZV55C20: Стабилитрон; SP: Стабилитрон 1SMA5922 BT3; Value: 1SMA5922 BT3
VD10 VD17 VD19 = MBRA340: Диод SMAJ33СA-TR; SP: Диод SMAJ33СA-TR; Value: SMAJ33СA
VD11 VD13 VD31 VD32 = BZV55C20: Стабилитрон; SP: Стабилитрон BZV55C5V6; Value: BZV55C5V6
VD12 VD33 = U05J4B48: Диодный мост; SP: Диод MB10S-TP; Value: MB10S-TP
VD16 = PMEG2020AEA: Диод Шоттки PMEG2020AEA; SP: Диод Шоттки PMEG2020AEA; Value: PMEG2020AEA
VD23-VD26 VD28 VD29 = SMB5920: SURFACE MOUNT SILICON ZENER DIODES  3.0Watts; Value: SMB5920
VT1 VT2 = IRLML2803: IRLML2803 Полевой транзистор; SP: Транзистор IRLML2803; Value: IRLML2803
VT3 = BCX53-16: Транзистор; SP: Транзистор BCX53-16; Value: BCX53-16
VT4 = IRLML6302: IRLML6302 Полевой транзистор; SP: Транзистор IRLML6302; Value: IRLML6302
VT5 VT6 = PBSS304PZ: SP: Транзистор PBSS304PZ
X1-X5 X7 X8 = X: Вилка угловая однорядная, шаг 2,54мм
X6 = PLS-40-5_V2: Value: PLS-40-5
XP1-XP3 = TB-: SP: Вилка MSTBO 2,5/4-G1R KMGY
XP4-XP6 = TB-: SP: Вилка MSTBO 2,5/4-G1L KMGY
XT6 = PLD2-80R-16: Vlaue: PLD2-80R
ZQ1 = HC49U-8M0: Кварцевый резонатор d3x8мм; Value: HC49U-8M0
ZQ2 = DT-38T 32768: Кварцевый резонатор d3x8мм; Value: DT-38T 32768
D14 = BAT54S: Value: BAT54S
DA2 = AD822AR: Value: AD822AR
VD3 VD6 = LL4148: Value: LL4148